# Altium schematic sheet Sheet1.SchDoc
size A4; SheetNumber: 1; SheetTotal: 1; SPICEModelCacheJBNQVSDW: <root> / <DocumentId>JBNQVSDW</DocumentId> / <CacheFrame Number="0"> / <Model Name="led1" Kind="MDL"> / <Text>*Typ RED GaAs LED: Vf=1.7V Vr=4V If=40mA trr=3uS / *LED Pinout: 1=A, 2=K / .MODEL LED1 D (IS=93.2P RS=42M N=3.73 BV=4 IBV=10U / + CJO=2.97P VJ=.75 M=.333 TT=4.32U)</Text> / </Model> / </CacheFrame> / </root>
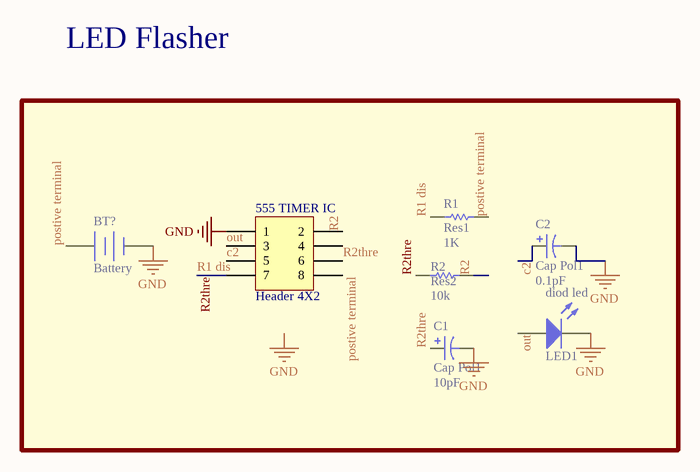
[diagram p0: Sheet1.SchDoc]

## Parts
555_TIMER_IC  Header 4X2  [HDR2X4]
BT?  Battery  [BAT-2]
C1  Cap Pol1  value 10pF  [RB7.6-15]
C2  Cap Pol1  value 0.1pF  [RB7.6-15]
diod_led  LED1  [LED-1]
R1  Res1  value 1K  [AXIAL-0.3]
R2  Res2  value 10k  [AXIAL-0.3]

## Nets
GND: 555_TIMER_IC.1 BT?.2(-) C1.2 C2.2 diod_led.2(K)
 R2thre: 555_TIMER_IC.6 555_TIMER_IC.7 C1.1 R1.1 R2.1  [also labelled R1 dis, R2thre]
c2: 555_TIMER_IC.5 C2.1
out: 555_TIMER_IC.3 diod_led.1(A)
postive terminal: 555_TIMER_IC.8 BT?.1(+) R1.2
R2: 555_TIMER_IC.2 R2.2

Not connected (* = marked no-connect by the designer): 555_TIMER_IC 4

## Notes on the sheet
- LED Flasher
- Labels drawn without touching a wire or pin: GND

## Library data of the parts
555_TIMER_IC = Header 4X2: Header, 4-Pin, Dual row; LatestRevisionDate: 17-Jul-2002; LatestRevisionNote: Re-released for DXP Platform.; Publisher: Altium Limited
BT? = Battery: Multicell Battery; Published: 24-Mar-1999; LatestRevisionDate: 17-Jul-2002; LatestRevisionNote: Re-released for DXP Platform.; PackageReference: BAT-2; Publisher: Altium Limited; PackageDescription: Battery; 2 Leads
C1 C2 = Cap Pol1: Polarized Capacitor (Radial); Published: 8-Jun-2000; LatestRevisionDate: 17-Jul-2002; LatestRevisionNote: Re-released for DXP Platform.; PackageReference: RB7.6-15; Publisher: Altium Limited; PackageDescription: Polarized Capacitor (Radial); 2 Leads
diod_led = LED1: Typical RED GaAs LED; Published: 8-Jun-2000; LatestRevisionDate: 08-Jul-2005; LatestRevisionNote: Mech Layer 1 removed.; PackageReference: LED-1; Publisher: Altium Limited; PackageDescription: LED; 2 Leads
R1 R2 = Res1: Resistor; Published: 8-Jun-2000; LatestRevisionDate: 17-Jul-2002; LatestRevisionNote: Re-released for DXP Platform.; PackageReference: AXIAL-0.3; Publisher: Altium Limited; PackageDescription: Axial Device, Thru-Hole; 2 Leads; 0.3 in Pin Spacing